# Altium project 3 phase NPC inverter.PrjPcb
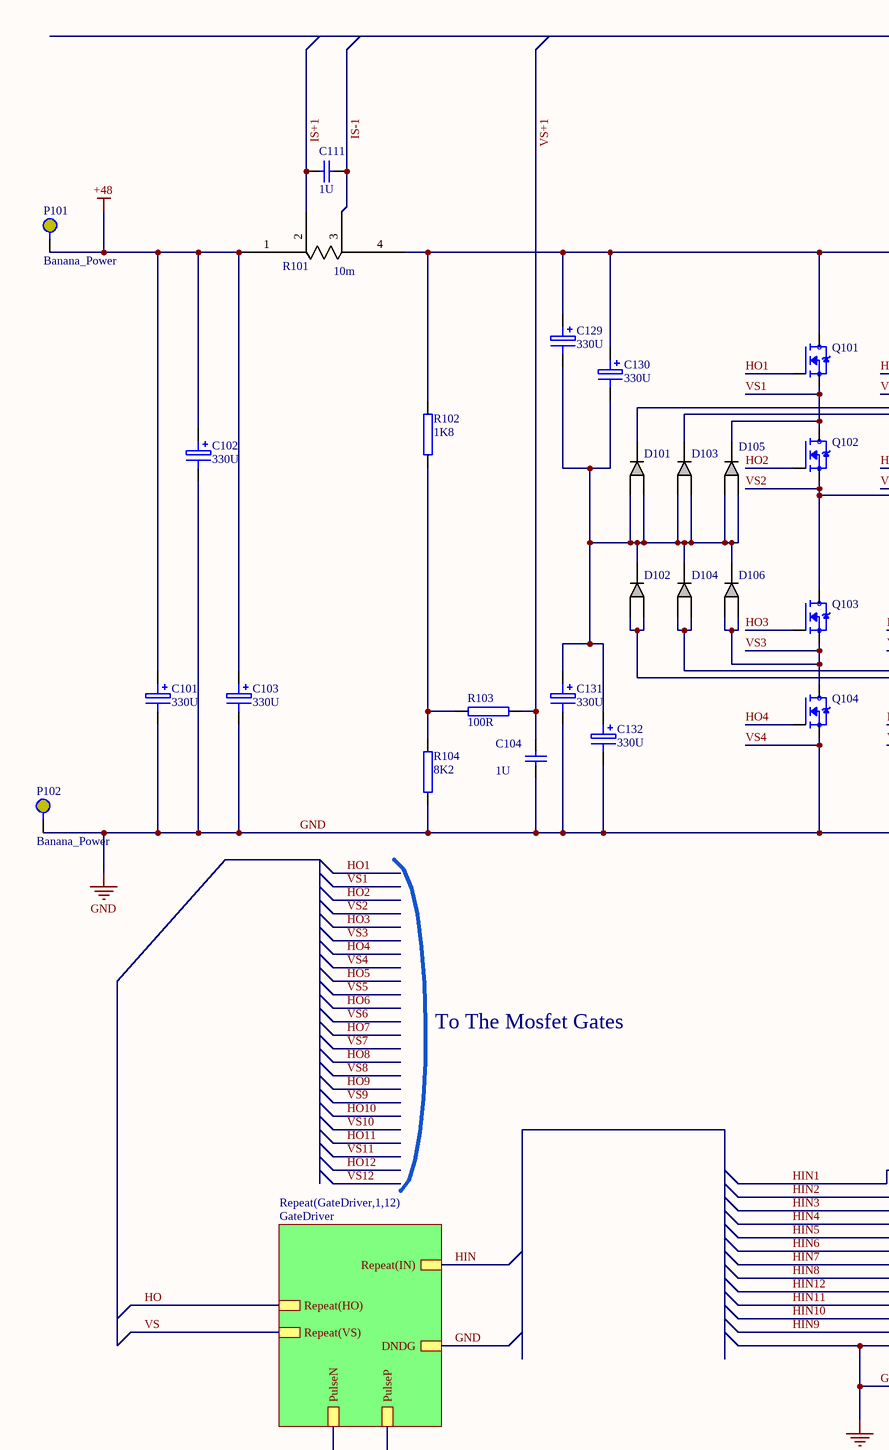
[diagram p0: 3 phase NPC inverter.SchDoc, top left]
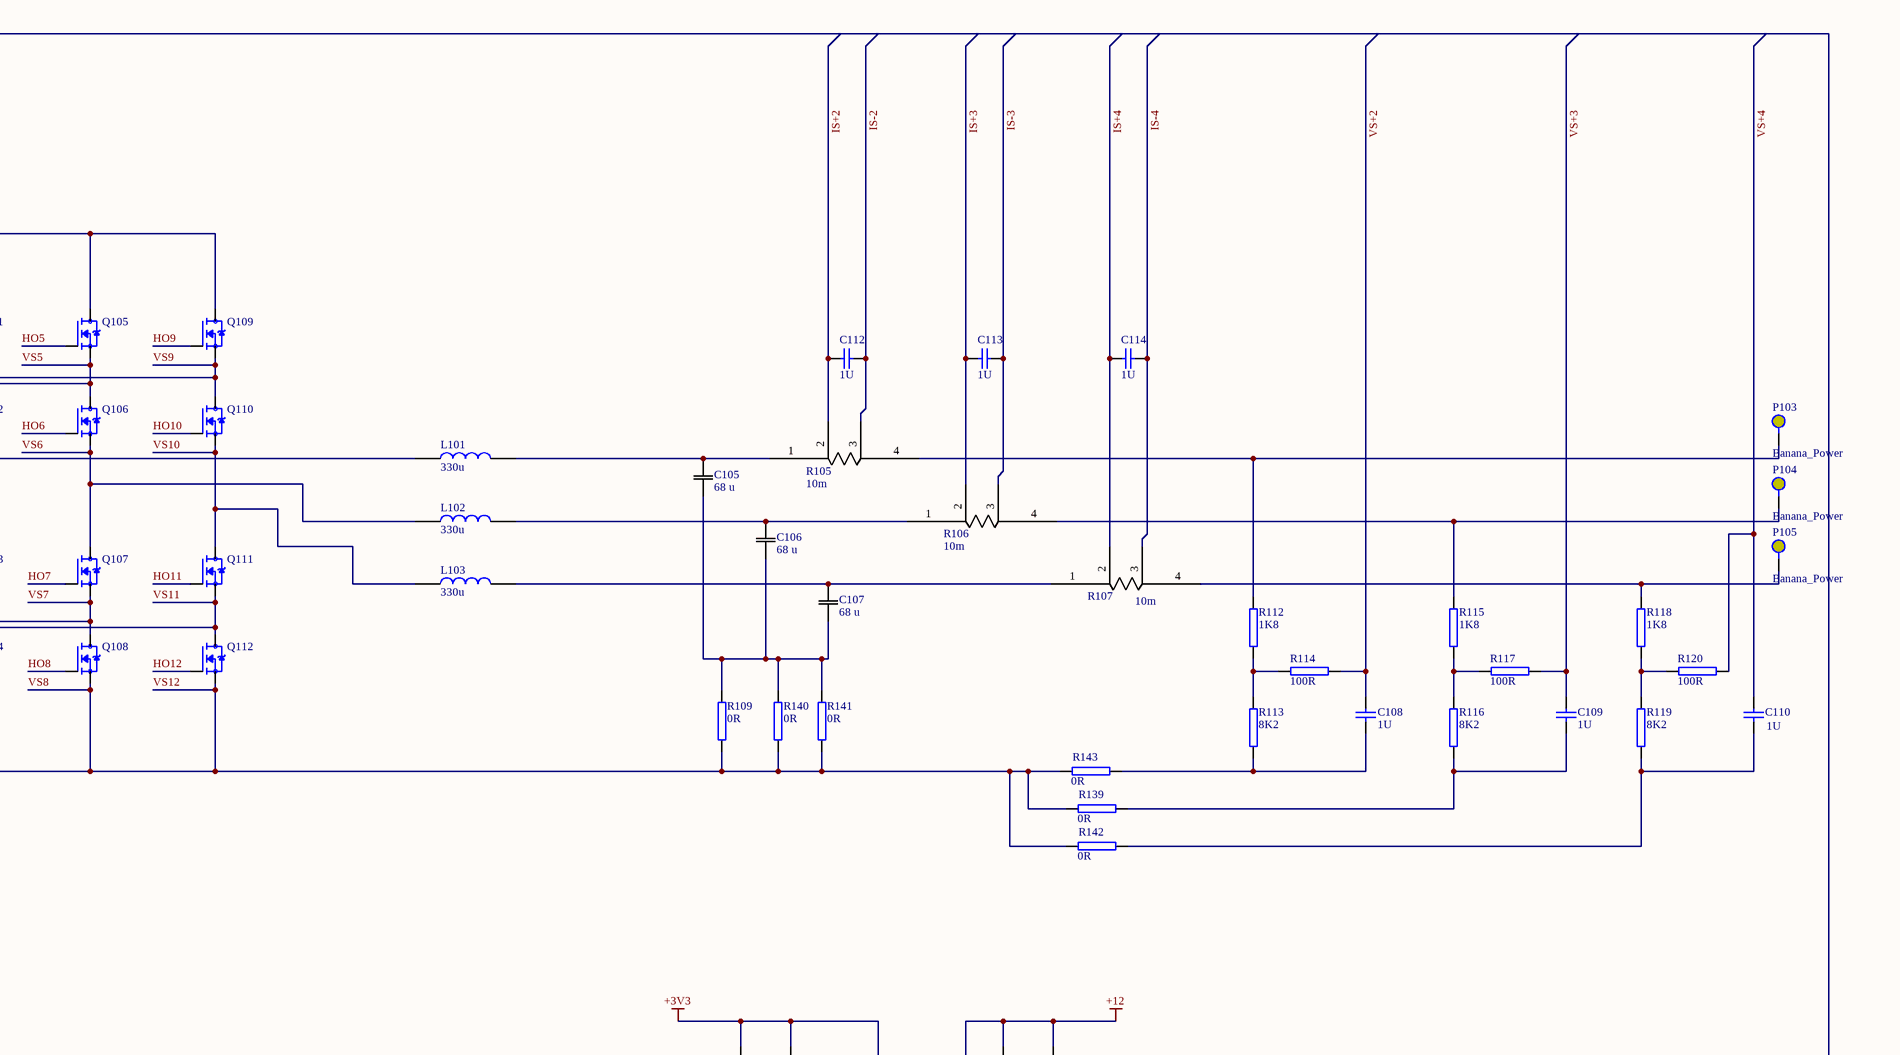
[diagram p1: 3 phase NPC inverter.SchDoc, top right]
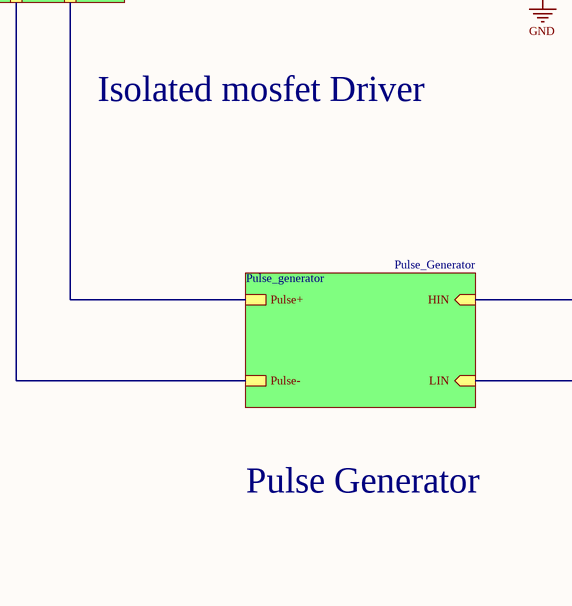
[diagram p2: 3 phase NPC inverter.SchDoc, bottom left]
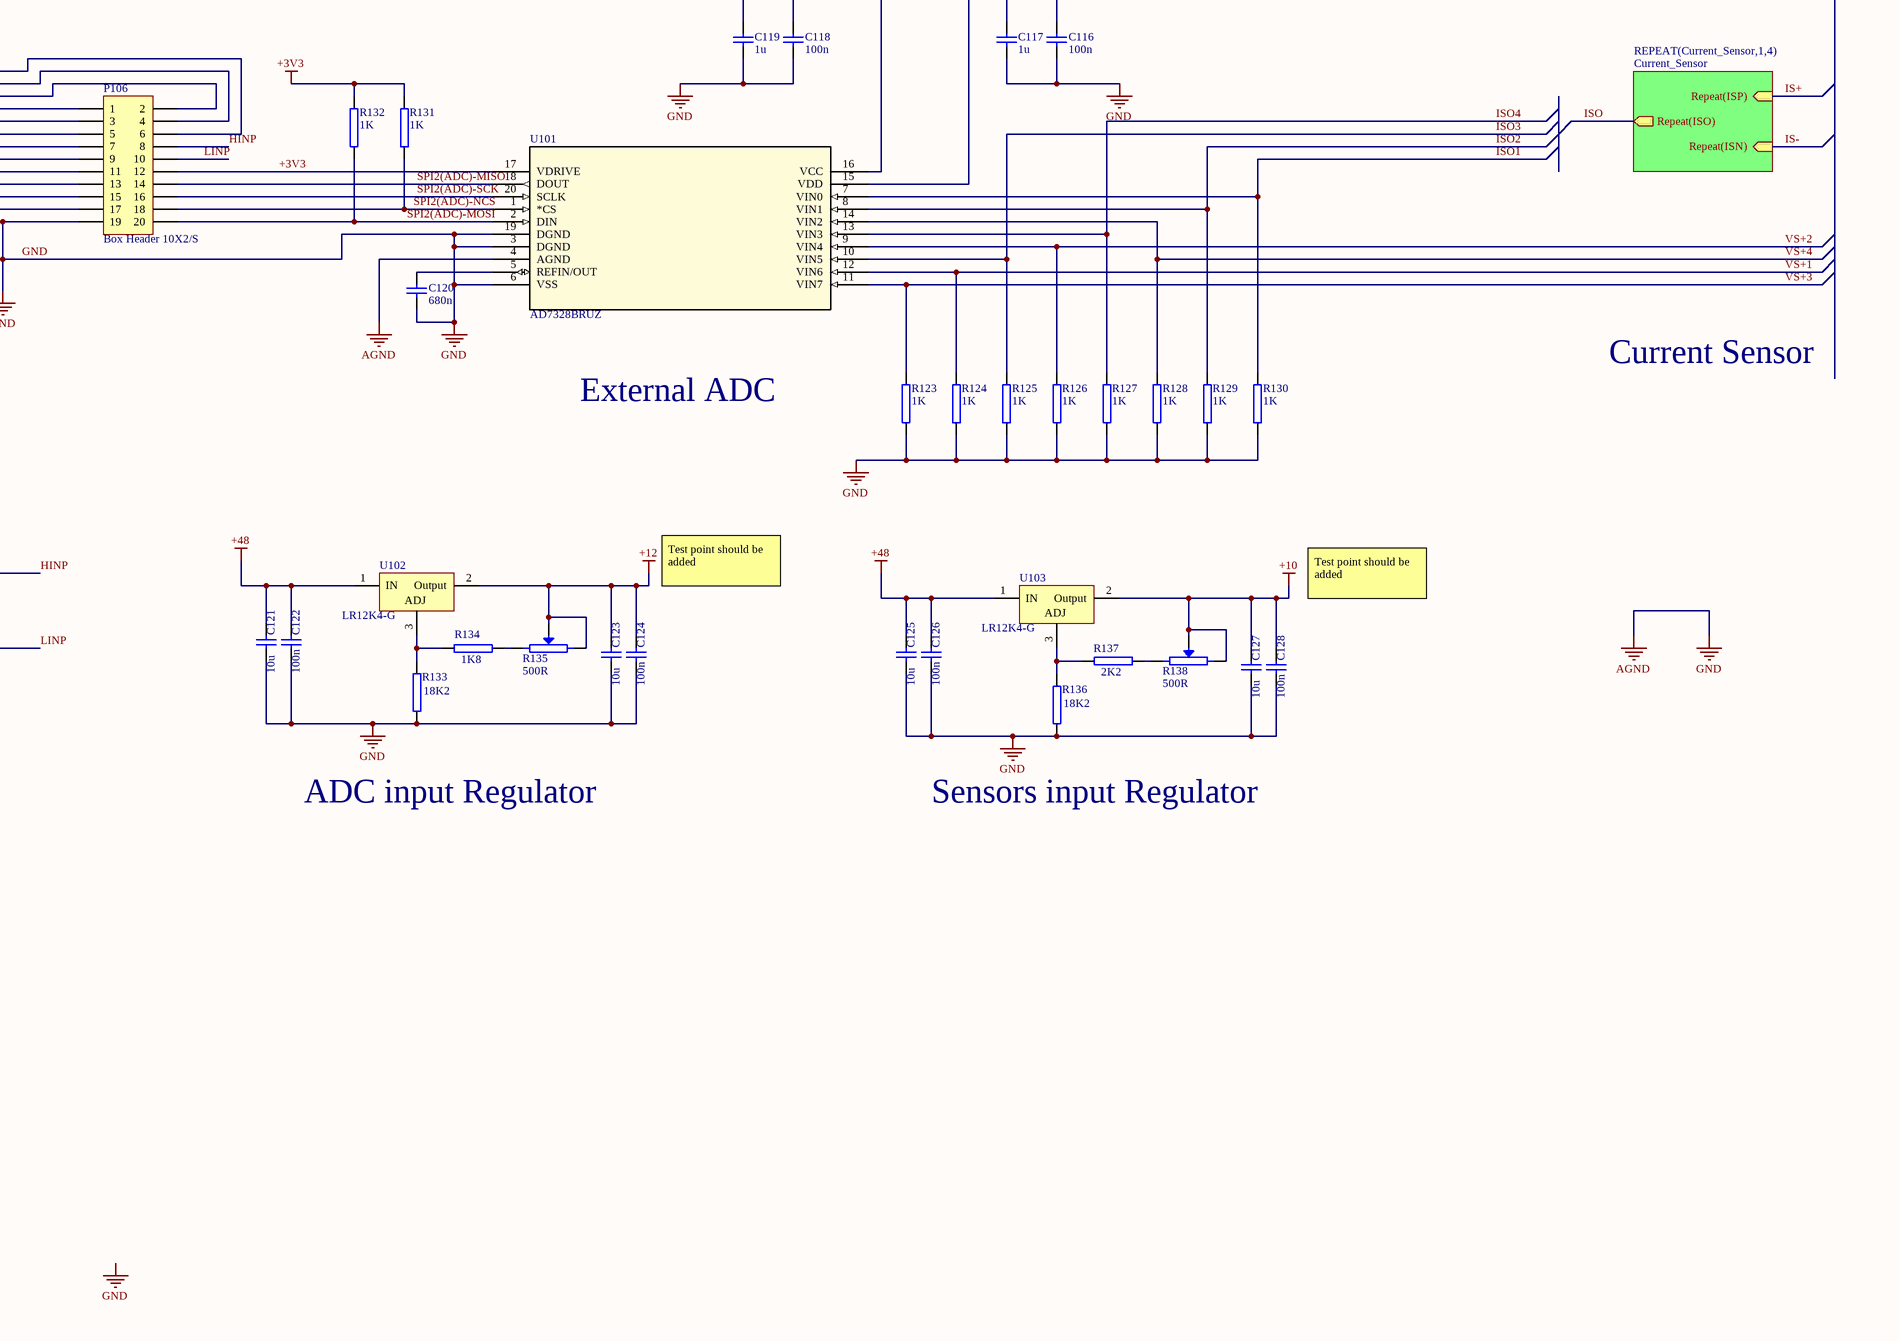
[diagram p3: 3 phase NPC inverter.SchDoc, bottom right]
4 sheets, 134 parts. Net scope: hierarchical (ports join the sheet entries above them; power ports are global).
Board file: 3 Phase NPC Inverter(ZIXING CAI,SICHENG LI).PcbDoc
Sheets:
  3 phase NPC inverter.SchDoc
    Current_Sensor1 = Current_Sensor.SchDoc
    Current_Sensor2 = Current_Sensor.SchDoc
    Current_Sensor3 = Current_Sensor.SchDoc
    Current_Sensor4 = Current_Sensor.SchDoc
    GateDriver1 = GateDriver.SchDoc
    GateDriver2 = GateDriver.SchDoc
    GateDriver3 = GateDriver.SchDoc
    GateDriver4 = GateDriver.SchDoc
    GateDriver5 = GateDriver.SchDoc
    GateDriver6 = GateDriver.SchDoc
    GateDriver7 = GateDriver.SchDoc
    GateDriver8 = GateDriver.SchDoc
    GateDriver9 = GateDriver.SchDoc
    GateDriver10 = GateDriver.SchDoc
    GateDriver11 = GateDriver.SchDoc
    GateDriver12 = GateDriver.SchDoc
    Pulse_generator = Pulse_Generator.SchDoc

## Sheet 3 phase NPC inverter.SchDoc
size A2; SheetNumber: 1; SheetTotal: 4

### Parts
C101  330U  [CAPP300-600_AUT]
C102  330U  [CAPP300-600_AUT]
C103  330U  [CAPP300-600_AUT]
C104  1U  [CAP_1206]
C105  68 u  [B32526R3686K000]
C106  68 u  [B32526R3686K000]
C107  68 u  [B32526R3686K000]
C108  1U  [CAP_1206]
C109  1U  [CAP_1206]
C110  1U  [CAP_1206]
C111  1U  [CAP_1206]
C112  1U  [CAP_1206]
C113  1U  [CAP_1206]
C114  1U  [CAP_1206]
C116  100n  [CAP_1206]
C117  1u  [CAP_1206]
C118  100n  [CAP_1206]
C119  1u  [CAP_1206]
C120  680n  [CAP_1206]
C121  10u  [CAP_1206]
C122  100n  [CAP_1206]
C123  10u  [CAP_1206]
C124  100n  [CAP_1206]
C125  10u  [CAP_1206]
C126  100n  [CAP_1206]
C127  10u  [CAP_1206]
C128  100n  [CAP_1206]
C129  330U  [CAPP300-600_AUT]
C130  330U  [CAPP300-600_AUT]
C131  330U  [CAPP300-600_AUT]
C132  330U  [CAPP300-600_AUT]
D101  FSV20100V  [SOT_20100V_ONS-M]  (value not drawn)
D102  FSV20100V  [SOT_20100V_ONS-M]  (value not drawn)
D103  FSV20100V  [SOT_20100V_ONS-M]  (value not drawn)
D104  FSV20100V  [SOT_20100V_ONS-M]  (value not drawn)
D105  FSV20100V  [SOT_20100V_ONS-M]  (value not drawn)
D106  FSV20100V  [SOT_20100V_ONS-M]  (value not drawn)
L101  330u  [1140-331K-RC]
L102  330u  [1140-331K-RC]
L103  330u  [1140-331K-RC]
P101  Banana_Power  [Banana_Power]
P102  Banana_Power  [Banana_Power]
P103  Banana_Power  [Banana_Power]
P104  Banana_Power  [Banana_Power]
P105  Banana_Power  [Banana_Power]
P106  Box Header 10X2/S  [FKV20SN_AUT]
Q101  MCTL80N20Y-TP  [TOLL-8L]  (value not drawn)
Q102  MCTL80N20Y-TP  [TOLL-8L]  (value not drawn)
Q103  MCTL80N20Y-TP  [TOLL-8L]  (value not drawn)
Q104  MCTL80N20Y-TP  [TOLL-8L]  (value not drawn)
Q105  MCTL80N20Y-TP  [TOLL-8L]  (value not drawn)
Q106  MCTL80N20Y-TP  [TOLL-8L]  (value not drawn)
Q107  MCTL80N20Y-TP  [TOLL-8L]  (value not drawn)
Q108  MCTL80N20Y-TP  [TOLL-8L]  (value not drawn)
Q109  MCTL80N20Y-TP  [TOLL-8L]  (value not drawn)
Q110  MCTL80N20Y-TP  [TOLL-8L]  (value not drawn)
Q111  MCTL80N20Y-TP  [TOLL-8L]  (value not drawn)
Q112  MCTL80N20Y-TP  [TOLL-8L]  (value not drawn)
R101  10m  [WSL3673R_002-01]
R102  1K8  [RES_1206]
R103  100R  [RES_1206]
R104  8K2  [RES_1206]
R105  10m  [WSL3673R_002-01]
R106  10m  [WSL3673R_002-01]
R107  10m  [WSL3673R_002-01]
R109  0R  [RES_1206]
R112  1K8  [RES_1206]
R113  8K2  [RES_1206]
R114  100R  [RES_1206]
R115  1K8  [RES_1206]
R116  8K2  [RES_1206]
R117  100R  [RES_1206]
R118  1K8  [RES_1206]
R119  8K2  [RES_1206]
R120  100R  [RES_1206]
R123  1K  [RES_1206]
R124  1K  [RES_1206]
R125  1K  [RES_1206]
R126  1K  [RES_1206]
R127  1K  [RES_1206]
R128  1K  [RES_1206]
R129  1K  [RES_1206]
R130  1K  [RES_1206]
R131  1K  [RES_1206]
R132  1K  [RES_1206]
R133  18K2  [RES_1206]
R134  1K8  [RES_1206]
R135  500R  [3296W]
R136  18K2  [RES_1206]
R137  2K2  [RES_1206]
R138  500R  [3296W]
R139  0R  [RES_1206]
R140  0R  [RES_1206]
R141  0R  [RES_1206]
R142  0R  [RES_1206]
R143  0R  [RES_1206]
U101  AD7328BRUZ  [TSSOP20_44]
U102  LR12K4-G  [D PAK (TO-252-3)]
U103  LR12K4-G  [D PAK (TO-252-3)]

### Sub-sheets
Pulse_generator = Pulse_Generator: HIN (in), LIN (in), Pulse+, Pulse-
REPEAT(Current_Sensor,1,4) = Current_Sensor: Repeat(ISP) (in), Repeat(ISN) (in), Repeat(ISO) (out)
Repeat(GateDriver,1,12) = GateDriver: PulseN, PulseP, DNDG, Repeat(HO), Repeat(IN), Repeat(VS)

### Nets
+3V3: C118.2 C119.2 P106.12 R131.2 R132.2 U101.16(VCC) U101.17(VDRIVE)
+10: C127.2 C128.2 R138.2(BOT) R138.W(TAP) U103.2(Output)
+12: C116.2 C117.2 C123.2 C124.2 R135.2(BOT) R135.W(TAP) U101.15(VDD) U102.2(Output)
+48: C101.1 C102.1 C103.1 C121.2 C122.2 C125.2 C126.2 P101.1 R101.1 U102.1(IN) U103.1(IN)
GND: C101.2 C102.2 C103.2 C104.1 C116.1 C117.1 C118.1 C119.1 C120.1 C121.1 C122.1 C123.1 C124.1 C125.1 C126.1 C127.1 C128.1 C131.2 C132.2 P102.1 P106.19 Q104.2(S) Q108.2(S) Q112.2(S) R104.1 R109.2 R123.1 R124.1 R125.1 R126.1 R127.1 R128.1 R129.1 R130.1 R133.1 R136.1 R139.1 R140.2 R141.2 R142.1 R143.1 U101.3(DGND) U101.4(AGND) U101.6(VSS) U101.19(DGND) ; sheet Repeat(GateDriver,1,12)/DNDG  [also labelled AGND, VS12, VS4, VS8]
HIN: sheet Repeat(GateDriver,1,12)/Repeat(IN)
HIN1: P106.6
HIN2: P106.4
HIN3: P106.2
HIN4: P106.1
HIN5: P106.3
HIN6: P106.5
HIN7: P106.7
HIN8: P106.9
HIN9: P106.17
HIN10: P106.15
HIN11: P106.13
HIN12: P106.11
HINP: P106.8 ; sheet Pulse_generator/HIN
HN: sheet Repeat(GateDriver,1,12)/PulseN, sheet Pulse_generator/Pulse-
HO: sheet Repeat(GateDriver,1,12)/Repeat(HO)
HO1: Q101.1(G)
HO2: Q102.1(G)
HO3: Q103.1(G)
HO4: Q104.1(G)
HO5: Q105.1(G)
HO6: Q106.1(G)
HO7: Q107.1(G)
HO8: Q108.1(G)
HO9: Q109.1(G)
HO10: Q110.1(G)
HO11: Q111.1(G)
HO12: Q112.1(G)
IS+: sheet REPEAT(Current_Sensor,1,4)/Repeat(ISP)
IS+1: C111.2 R101.2
IS+2: C112.2 R105.2
IS+3: C113.2 R106.2
IS+4: C114.2 R107.2
IS-: sheet REPEAT(Current_Sensor,1,4)/Repeat(ISN)
IS-1: C111.1 R101.3
IS-2: C112.1 R105.3
IS-3: C113.1 R106.3
IS-4: C114.1 R107.3
ISO: sheet REPEAT(Current_Sensor,1,4)/Repeat(ISO)
ISO1: R130.2 U101.7(VIN0)
ISO2: R129.2 U101.8(VIN1)
ISO3: R125.2 U101.10(VIN5)
ISO4: R127.2 U101.13(VIN3)
LINP: P106.10 ; sheet Pulse_generator/LIN
SPI2(ADC)-MISO: P106.14 U101.18(DOUT)
SPI2(ADC)-MOSI: P106.20 R132.1 U101.2(DIN)
SPI2(ADC)-NCS: P106.18 R131.1 U101.1(*CS)
SPI2(ADC)-SCK: P106.16 U101.20(SCLK)
VS: sheet Repeat(GateDriver,1,12)/Repeat(VS)
VS1: D105.3(C) Q101.2(S) Q102.3(D)
VS2: L101.1 Q102.2(S) Q103.3(D)
VS3: D106.1(A) D106.2(A) Q103.2(S) Q104.3(D)
VS5: D103.3(C) Q105.2(S) Q106.3(D)
VS6: L102.1 Q106.2(S) Q107.3(D)
VS7: D104.1(A) D104.2(A) Q107.2(S) Q108.3(D)
VS9: D101.3(C) Q109.2(S) Q110.3(D)
VS10: L103.1 Q110.2(S) Q111.3(D)
VS11: D102.1(A) D102.2(A) Q111.2(S) Q112.3(D)
VS+1: C104.2 R103.1 R124.2 U101.12(VIN6)
VS+2: C108.2 R114.1 R126.2 U101.9(VIN4)
VS+3: C109.2 R117.1 R123.2 U101.11(VIN7)
VS+4: C110.2 R120.1 R128.2 U101.14(VIN2)
NetC105_1: C105.1 C106.1 C107.1 R109.1 R140.1 R141.1
NetC105_2: C105.2 L101.2 R105.1
NetC106_2: C106.2 L102.2 R106.1
NetC107_2: C107.2 L103.2 R107.1
NetC108_1: C108.1 R113.1 R143.2
NetC109_1: C109.1 R116.1 R139.2
NetC110_1: C110.1 R119.1 R142.2
NetC120_2: C120.2 U101.5(REFIN/OUT)
NetC129_1: C129.1 C130.1 Q101.3(D) Q105.3(D) Q109.3(D) R101.4 R102.2
NetC129_2: C129.2 C130.2 C131.1 C132.1 D101.1(A) D101.2(A) D102.3(C) D103.1(A) D103.2(A) D104.3(C) D105.1(A) D105.2(A) D106.3(C)
NetC406_2: sheet Repeat(GateDriver,1,12)/PulseP, sheet Pulse_generator/Pulse+
NetP103_1: P103.1 R105.4 R112.2
NetP104_1: P104.1 R106.4 R115.2
NetP105_1: P105.1 R107.4 R118.2
NetR102_1: R102.1 R103.2 R104.2
NetR112_1: R112.1 R113.2 R114.2
NetR115_1: R115.1 R116.2 R117.2
NetR118_1: R118.1 R119.2 R120.2
NetR133_2: R133.2 R134.2 U102.3(ADJ)
NetR134_1: R134.1 R135.1(TOP)
NetR136_2: R136.2 R137.2 U103.3(ADJ)
NetR137_1: R137.1 R138.1(TOP)

### Notes on the sheet
- To The Mosfet Gates
- Isolated mosfet Driver
- External ADC
- Current Sensor
- Test point should be added
- Pulse Generator
- ADC input Regulator
- Sensors input Regulator
- Labels drawn without touching a wire or pin: GND

### Library data of the parts
C101-C103 C129-C132 = CAPP300-600: Polarized Aluminum Capacitor, Through Hole, Pitch 300mil, Body 600mil (Dia)
C104 C108-C114 C116-C128 = CAPN 1206: Non Polarized Capacitor, SMD, 1206
C105-C107 = B32526R3686K000: 68 µF Film Capacitor 160V 250V Polyester, Polyethylene Terephthalate (PET), Metallized Radial / https://www.digikey.co.nz/en/products/detail/epcos-tdk-electronics/B32526R3686K000/3490213; ComponentLink1Description: New link; ComponentLink1URL: https://www.digikey.co.nz/en/products/detail/epcos-tdk-electronics/B32526R3686K000/3490213
D101-D106 = FSV20100V: Diode 100 V 20A Surface Mount TO-277-3 / https://www.digikey.co.nz/en/products/detail/onsemi/FSV20100V/5306665; ComponentLink1Description: New link; ComponentLink1URL: https://www.digikey.co.nz/en/products/detail/onsemi/FSV20100V/5306665
L101-L103 = 1140-331K-RC: Power Inductors - Leaded 330uH 10% / https://nz.mouser.com/ProductDetail/Bourns/1140-331K-RC?qs=wiQ7G1Lt8gwP8A01VI%2FcoA%3D%3D; ComponentLink1Description: New link; ComponentLink1URL: https://nz.mouser.com/ProductDetail/Bourns/1140-331K-RC?qs=wiQ7G1Lt8gwP8A01VI%2FcoA%3D%3D
P101-P105 = Banana_Power: 4mm pitch
P106 = Box Header 10X2/S: Header, Box, 20 Way, 2.54mm, Straght; Supplier 1: Farnell; Supplier Part Number 1: 8395942
Q101-Q112 = MCTL80N20Y-TP: N-Channel 200 V 80A (Tc) 250W (Tj) Surface Mount TOLL-8L
R101 R105-R107 = WSL3673R-01: Current Shunt / Kelvin 4W 0.002- 0.01
R102-R104 R109 R112-R120 R123-R134 R136 R137 R139-R143 = Resistor 1206: Resistor, SMD, 1206
R135 R138 = 3296W-1-104LF: 3296W Series, 3/8 ” Square Potentiometer, 100k, 10%,  0.5 Watts, Multi Turn / Part #: PV36W501C01B00; Supplier 1: Farnell; Supplier Part Number 1: 9353194
U101 = AD7328BRUZ: ADC 12 Bit / Package TSSOP20
U102 U103 = LR12K4-G: Adj Positive Regulator / Linear. 12V dropout V. / 2W

## Sheet Current_Sensor.SchDoc
size A3; SheetNumber: 2; SheetTotal: 4
Used 4 times, as channels Current_Sensor1, Current_Sensor2, Current_Sensor3, Current_Sensor4. Parts and nets are listed once, with the designators drawn on the sheet.
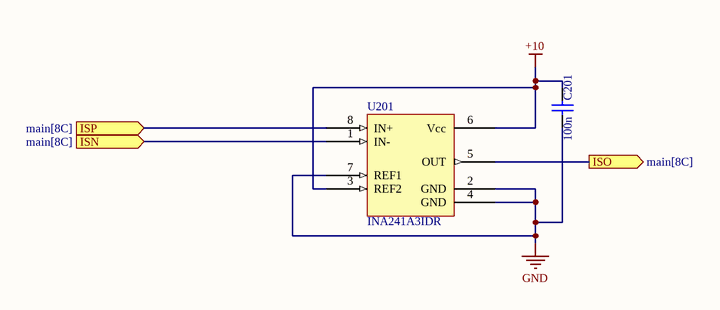
[diagram p4: Current_Sensor.SchDoc]

### Parts
C201  100n  [CAP_1206]
U201  INA241A3IDR  [SOIC8_M]

### Ports
ISN (in, see main[8C]), ISO (out, see main[8C]), ISP (in, see main[8C])

### Nets
+10: C201.2 U201.3(REF2) U201.6(Vcc)
GND: C201.1 U201.2(GND) U201.4(GND) U201.7(REF1)
ISN: U201.1(IN-) ; port ISN
ISO: U201.5(OUT) ; port ISO
ISP: U201.8(IN+) ; port ISP

### Channels
Current_Sensor1: designators end in A; ports ISN=IS-1 ISO=ISO1 ISP=IS+1
Current_Sensor2: designators end in B; ports ISN=IS-2 ISO=ISO2 ISP=IS+2
Current_Sensor3: designators end in C; ports ISN=IS-3 ISO=ISO3 ISP=IS+3
Current_Sensor4: designators end in D; ports ISN=IS-4 ISO=ISO4 ISP=IS+4

### Library data of the parts
C201 = CAPN 1206: Non Polarized Capacitor, SMD, 1206
U201 = INA241A3IDR: Current Sense Amp

## Sheet GateDriver.SchDoc
size A4; SheetNumber: 4; SheetTotal: 4
Used 12 times, as channels GateDriver1, GateDriver2, GateDriver3, GateDriver4, GateDriver5, GateDriver6, GateDriver7, GateDriver8, GateDriver9, GateDriver10, GateDriver11, GateDriver12. Parts and nets are listed once, with the designators drawn on the sheet.
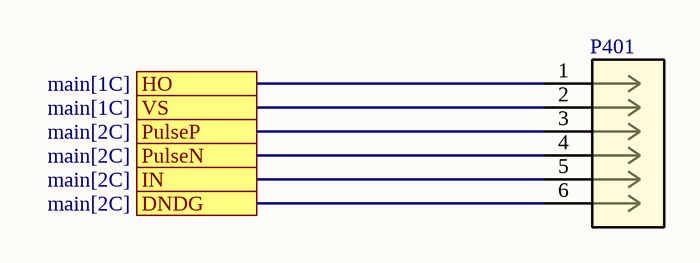
[diagram p5: GateDriver.SchDoc]

### Parts
P401  EBC06DCWN  [CONN12_EBC06DCWN_SUL]  (value not drawn)

### Ports
DNDG (see main[2C]), HO (see main[1C]), IN (see main[2C]), PulseN (see main[2C]), PulseP (see main[2C]), VS (see main[1C])

### Nets
DNDG: P401.6 ; port DNDG
HO: P401.1 ; port HO
IN: P401.5 ; port IN
PulseN: P401.4 ; port PulseN
PulseP: P401.3 ; port PulseP
VS: P401.2 ; port VS

### Channels
GateDriver1: designators end in A; ports DNDG=GND HO=HO1 IN=HIN1 PulseN=HN PulseP=NetC406_2 VS=VS1
GateDriver2: designators end in B; ports DNDG=GND HO=HO2 IN=HIN2 PulseN=HN PulseP=NetC406_2 VS=VS2
GateDriver3: designators end in C; ports DNDG=GND HO=HO3 IN=HIN3 PulseN=HN PulseP=NetC406_2 VS=VS3
GateDriver4: designators end in D; ports DNDG=GND HO=HO4 IN=HIN4 PulseN=HN PulseP=NetC406_2 VS=GND
GateDriver5: designators end in E; ports DNDG=GND HO=HO5 IN=HIN5 PulseN=HN PulseP=NetC406_2 VS=VS5
GateDriver6: designators end in F; ports DNDG=GND HO=HO6 IN=HIN6 PulseN=HN PulseP=NetC406_2 VS=VS6
GateDriver7: designators end in G; ports DNDG=GND HO=HO7 IN=HIN7 PulseN=HN PulseP=NetC406_2 VS=VS7
GateDriver8: designators end in H; ports DNDG=GND HO=HO8 IN=HIN8 PulseN=HN PulseP=NetC406_2 VS=GND
GateDriver9: designators end in I; ports DNDG=GND HO=HO9 IN=HIN9 PulseN=HN PulseP=NetC406_2 VS=VS9
GateDriver10: designators end in J; ports DNDG=GND HO=HO10 IN=HIN10 PulseN=HN PulseP=NetC406_2 VS=VS10
GateDriver11: designators end in K; ports DNDG=GND HO=HO11 IN=HIN11 PulseN=HN PulseP=NetC406_2 VS=VS11
GateDriver12: designators end in L; ports DNDG=GND HO=HO12 IN=HIN12 PulseN=HN PulseP=NetC406_2 VS=GND

### Library data of the parts
P401 = EBC06DCWN: 12 Position Female Connector Non Specified - Dual Edge Gold 0.100" (2.54mm) Blue / https://www.digikey.co.nz/en/products/detail/sullins-connector-solutions/EBC06DCWN/927245; ComponentLink1Description: New link; ComponentLink1URL: https://www.digikey.co.nz/en/products/detail/sullins-connector-solutions/EBC06DCWN/927245

## Sheet Pulse_Generator.SchDoc
size A3; SheetNumber: 3; SheetTotal: 4
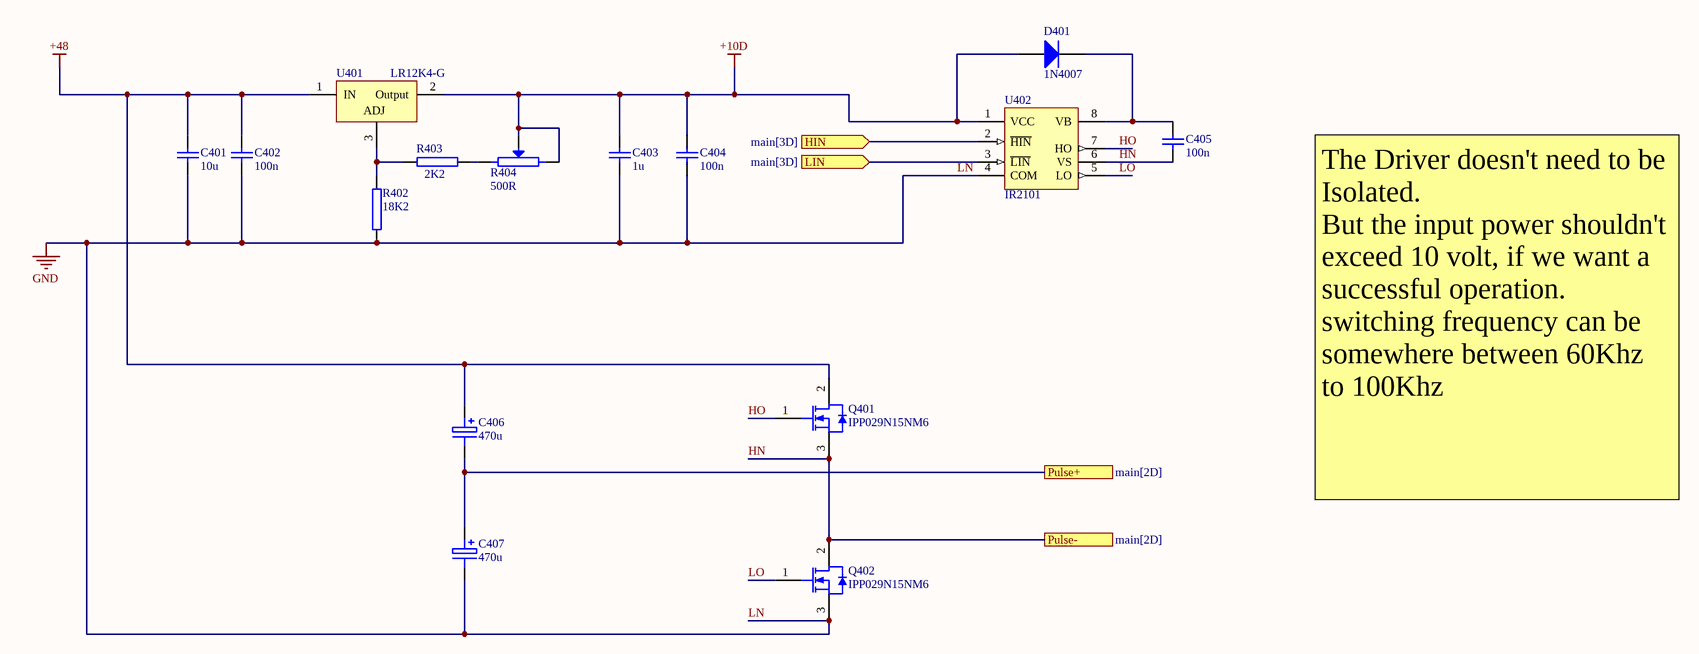
[diagram p6: Pulse_Generator.SchDoc]

### Parts
C401  10u  [CAP_1206]
C402  100n  [CAP_1206]
C403  1u  [CAP_1206]
C404  100n  [CAP_1206]
C405  100n  [RAD-0.2_AUT]
C406  470u  [CAPP300-600_AUT]
C407  470u  [CAPP300-600_AUT]
D401  1N4007  [DIODE0.4_AUT]
Q401  IPP029N15NM6  [TO-220V]
Q402  IPP029N15NM6  [TO-220V]
R402  18K2  [RES_1206]
R403  2K2  [RES_1206]
R404  500R  [3296W]
U401  LR12K4-G  [D PAK (TO-252-3)]
U402  IR2101  [DIP8_AUT]

### Ports
HIN (in, see main[3D]), LIN (in, see main[3D]), Pulse+ (see main[2D]), Pulse- (see main[2D])

### Nets
+10D: C403.2 C404.2 D401.A R404.2(BOT) R404.W(TAP) U401.2(Output) U402.1(VCC)
+48: C401.2 C402.2 C406.1 Q401.2(D) U401.1(IN)
GND: C401.1 C402.1 C403.1 C404.1 C407.2 Q402.3(S) R402.1 U402.4(COM)  [also labelled LN]
HINP: U402.2(~{HIN}) ; port HIN
HN: C405.1 Q401.3(S) Q402.2(D) U402.6(VS) ; port Pulse-
HO: Q401.1(G) U402.7(HO)
LINP: U402.3(~{LIN}) ; port LIN
LO: Q402.1(G) U402.5(LO)
NetC405_2: C405.2 D401.K U402.8(VB)
NetC406_2: C406.2 C407.1 ; port Pulse+
NetR402_2: R402.2 R403.2 U401.3(ADJ)
NetR403_1: R403.1 R404.1(TOP)

### Notes on the sheet
- The Driver doesn't need to be Isolated.
  But the input power shouldn't exceed 10 volt, if we want a successful operation.
  switching frequency can be somewhere between 60Khz to 100Khz

### Library data of the parts
C401-C404 = CAPN 1206: Non Polarized Capacitor, SMD, 1206
C405 = CAPN RAD0.2: Non Polarized Capacitor, Multilayer Ceramic Dipped Radial, Pitch 200mil
C406 C407 = CAPP300-600: as C101 on sheet 3 phase NPC inverter
D401 = 1N4007: Diode, Standard, 1A, 1000v; Supplier 1: Farnell; Supplier Part Number 1: 9549129
Q401 = FQP65N06: Insulated-Gate Field-Effect Transistor (IGFET), N-Channel, Enhancement, Body Diode, Pin 1 Gate, 2 Drain, 3 Source, 3 Pins- Through Hole TO-220-3
Q402 = FQP65N06: Insulated-Gate Field-Effect Transistor (IGFET), N-Channel, Enhancement, Body Diode, Pin 1 Gate, 2 Drain, 3 Source, 3 Pins - Through Hole TO-220-3
R402 R403 = Resistor 1206: Resistor, SMD, 1206
R404 = 3296W-1-104LF: as R135 on sheet 3 phase NPC inverter; Supplier 1: Farnell; Supplier Part Number 1: 9353194
U401 = LR12K4-G: as U102 on sheet 3 phase NPC inverter
U402 = IR2101_DIP: Half - Bridge Driver, MOSFET/IGBT, DIP8; Supplier 1: Farnell; Supplier Part Number 1: 8638829

## Nets that join several sheets
+10: 3 phase NPC inverter (5 pins), Current_Sensor1 (C201A.2 U201A.3 U201A.6), Current_Sensor2 (C201B.2 U201B.3 U201B.6), Current_Sensor3 (C201C.2 U201C.3 U201C.6), Current_Sensor4 (C201D.2 U201D.3 U201D.6)
+48: 3 phase NPC inverter (11 pins), Pulse_Generator (5 pins)
GND: 3 phase NPC inverter (45 pins), Current_Sensor1 (C201A.1 U201A.2 U201A.4 U201A.7), Current_Sensor2 (C201B.1 U201B.2 U201B.4 U201B.7), Current_Sensor3 (C201C.1 U201C.2 U201C.4 U201C.7), Current_Sensor4 (C201D.1 U201D.2 U201D.4 U201D.7), GateDriver1 (P401A.6), GateDriver2 (P401B.6), GateDriver3 (P401C.6), GateDriver4 (P401D.2 P401D.6), GateDriver5 (P401E.6), GateDriver6 (P401F.6), GateDriver7 (P401G.6), GateDriver8 (P401H.2 P401H.6), GateDriver9 (P401I.6), GateDriver10 (P401J.6), GateDriver11 (P401K.6), GateDriver12 (P401L.2 P401L.6), Pulse_Generator (8 pins)
HIN1: 3 phase NPC inverter (P106.6), GateDriver1 (P401A.5)
HIN2: 3 phase NPC inverter (P106.4), GateDriver2 (P401B.5)
HIN3: 3 phase NPC inverter (P106.2), GateDriver3 (P401C.5)
HIN4: 3 phase NPC inverter (P106.1), GateDriver4 (P401D.5)
HIN5: 3 phase NPC inverter (P106.3), GateDriver5 (P401E.5)
HIN6: 3 phase NPC inverter (P106.5), GateDriver6 (P401F.5)
HIN7: 3 phase NPC inverter (P106.7), GateDriver7 (P401G.5)
HIN8: 3 phase NPC inverter (P106.9), GateDriver8 (P401H.5)
HIN9: 3 phase NPC inverter (P106.17), GateDriver9 (P401I.5)
HIN10: 3 phase NPC inverter (P106.15), GateDriver10 (P401J.5)
HIN11: 3 phase NPC inverter (P106.13), GateDriver11 (P401K.5)
HIN12: 3 phase NPC inverter (P106.11), GateDriver12 (P401L.5)
HINP: 3 phase NPC inverter (P106.8), Pulse_Generator (U402.2)
HN: GateDriver1 (P401A.4), GateDriver2 (P401B.4), GateDriver3 (P401C.4), GateDriver4 (P401D.4), GateDriver5 (P401E.4), GateDriver6 (P401F.4), GateDriver7 (P401G.4), GateDriver8 (P401H.4), GateDriver9 (P401I.4), GateDriver10 (P401J.4), GateDriver11 (P401K.4), GateDriver12 (P401L.4), Pulse_Generator (C405.1 Q401.3 Q402.2 U402.6)
HO1: 3 phase NPC inverter (Q101.1), GateDriver1 (P401A.1)
HO2: 3 phase NPC inverter (Q102.1), GateDriver2 (P401B.1)
HO3: 3 phase NPC inverter (Q103.1), GateDriver3 (P401C.1)
HO4: 3 phase NPC inverter (Q104.1), GateDriver4 (P401D.1)
HO5: 3 phase NPC inverter (Q105.1), GateDriver5 (P401E.1)
HO6: 3 phase NPC inverter (Q106.1), GateDriver6 (P401F.1)
HO7: 3 phase NPC inverter (Q107.1), GateDriver7 (P401G.1)
HO8: 3 phase NPC inverter (Q108.1), GateDriver8 (P401H.1)
HO9: 3 phase NPC inverter (Q109.1), GateDriver9 (P401I.1)
HO10: 3 phase NPC inverter (Q110.1), GateDriver10 (P401J.1)
HO11: 3 phase NPC inverter (Q111.1), GateDriver11 (P401K.1)
HO12: 3 phase NPC inverter (Q112.1), GateDriver12 (P401L.1)
IS+1: 3 phase NPC inverter (C111.2 R101.2), Current_Sensor1 (U201A.8)
IS+2: 3 phase NPC inverter (C112.2 R105.2), Current_Sensor2 (U201B.8)
IS+3: 3 phase NPC inverter (C113.2 R106.2), Current_Sensor3 (U201C.8)
IS+4: 3 phase NPC inverter (C114.2 R107.2), Current_Sensor4 (U201D.8)
IS-1: 3 phase NPC inverter (C111.1 R101.3), Current_Sensor1 (U201A.1)
IS-2: 3 phase NPC inverter (C112.1 R105.3), Current_Sensor2 (U201B.1)
IS-3: 3 phase NPC inverter (C113.1 R106.3), Current_Sensor3 (U201C.1)
IS-4: 3 phase NPC inverter (C114.1 R107.3), Current_Sensor4 (U201D.1)
ISO1: 3 phase NPC inverter (R130.2 U101.7), Current_Sensor1 (U201A.5)
ISO2: 3 phase NPC inverter (R129.2 U101.8), Current_Sensor2 (U201B.5)
ISO3: 3 phase NPC inverter (R125.2 U101.10), Current_Sensor3 (U201C.5)
ISO4: 3 phase NPC inverter (R127.2 U101.13), Current_Sensor4 (U201D.5)
LINP: 3 phase NPC inverter (P106.10), Pulse_Generator (U402.3)
NetC406_2: GateDriver1 (P401A.3), GateDriver2 (P401B.3), GateDriver3 (P401C.3), GateDriver4 (P401D.3), GateDriver5 (P401E.3), GateDriver6 (P401F.3), GateDriver7 (P401G.3), GateDriver8 (P401H.3), GateDriver9 (P401I.3), GateDriver10 (P401J.3), GateDriver11 (P401K.3), GateDriver12 (P401L.3), Pulse_Generator (C406.2 C407.1)
VS1: 3 phase NPC inverter (D105.3 Q101.2 Q102.3), GateDriver1 (P401A.2)
VS2: 3 phase NPC inverter (L101.1 Q102.2 Q103.3), GateDriver2 (P401B.2)
VS3: 3 phase NPC inverter (D106.1 D106.2 Q103.2 Q104.3), GateDriver3 (P401C.2)
VS5: 3 phase NPC inverter (D103.3 Q105.2 Q106.3), GateDriver5 (P401E.2)
VS6: 3 phase NPC inverter (L102.1 Q106.2 Q107.3), GateDriver6 (P401F.2)
VS7: 3 phase NPC inverter (D104.1 D104.2 Q107.2 Q108.3), GateDriver7 (P401G.2)
VS9: 3 phase NPC inverter (D101.3 Q109.2 Q110.3), GateDriver9 (P401I.2)
VS10: 3 phase NPC inverter (L103.1 Q110.2 Q111.3), GateDriver10 (P401J.2)
VS11: 3 phase NPC inverter (D102.1 D102.2 Q111.2 Q112.3), GateDriver11 (P401K.2)